# EAGLE design MS_8ADCPWM (EAGLE 7.3.0)
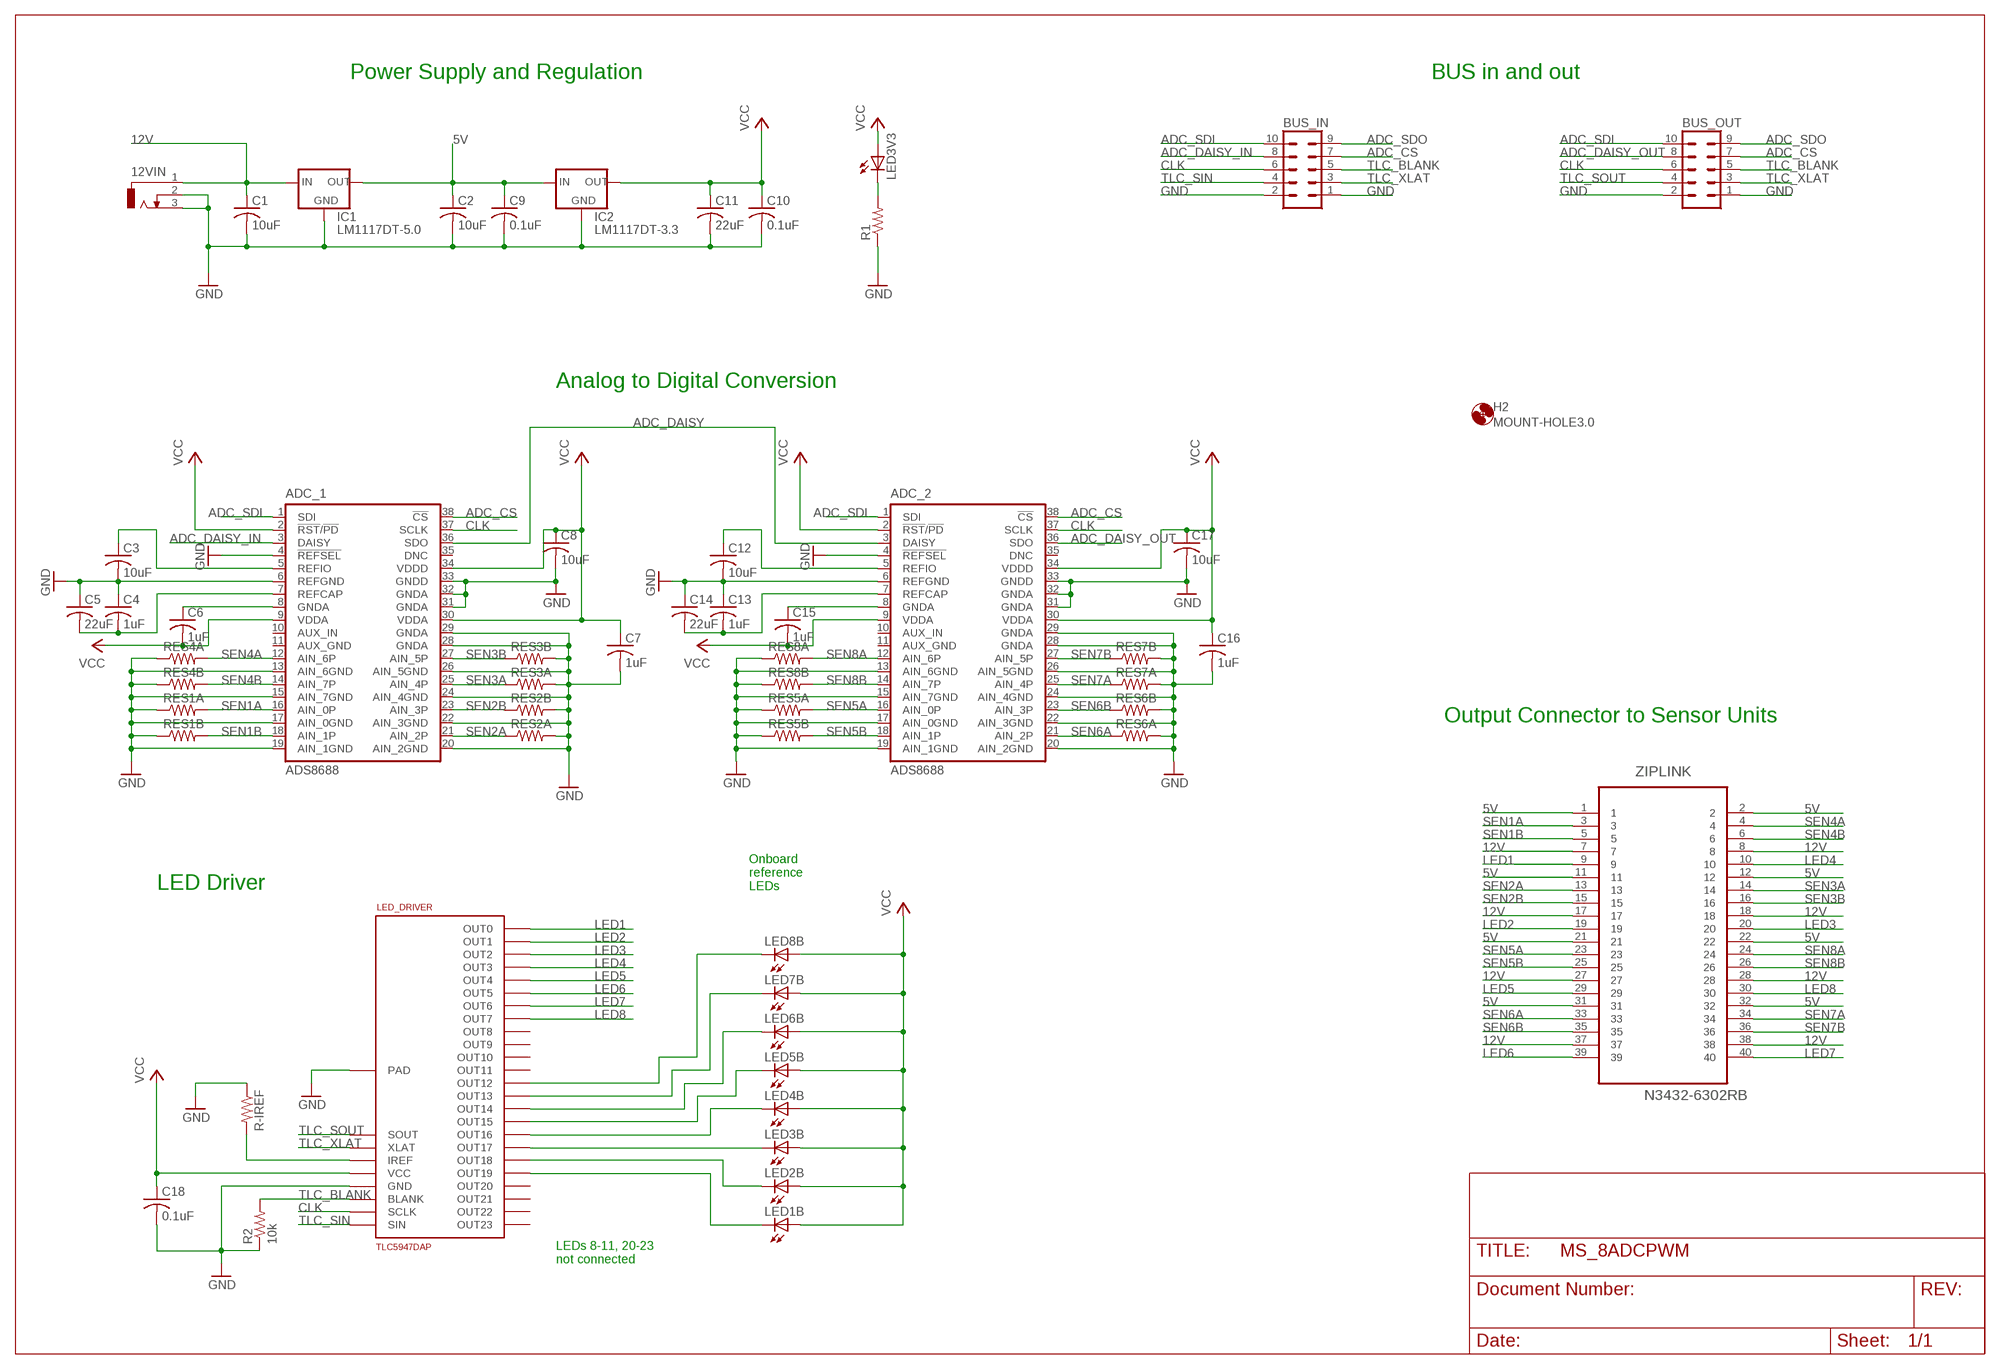
[diagram p0: schematic, sheet 1]

## Parts
12VIN  DCJ0303  [DCJ0303]
ADC_1  ADS8688  [DBT_R-PDSO-G38]
ADC_2  ADS8688  [DBT_R-PDSO-G38]
BUS_IN  ML10  [ML10]
BUS_OUT  ML10  [ML10]
C1  10uF  C-USC0805  [C0805]
C2  10uF  C-USC0805  [C0805]
C3  10uF  C-USC0805  [C0805]
C4  1uF  C-USC0805  [C0805]
C5  22uF  C-USC0805  [C0805]
C6  1uF  C-USC0805  [C0805]
C7  1uF  C-USC0805  [C0805]
C8  10uF  C-USC0805  [C0805]
C9  0.1uF  C-USC0805  [C0805]
C10  0.1uF  C-USC0805  [C0805]
C11  22uF  C-USC0805  [C0805]
C12  10uF  C-USC0805  [C0805]
C13  1uF  C-USC0805  [C0805]
C14  22uF  C-USC0805  [C0805]
C15  1uF  C-USC0805  [C0805]
C16  1uF  C-USC0805  [C0805]
C17  10uF  C-USC0805  [C0805]
C18  0.1uF  C-USC0805  [C0805]
H2  MOUNT-HOLE3.0  [3,0]
IC1  LM1117DT-5.0  [TO252]
IC2  LM1117DT-3.3  [TO252]
LED1B  LEDSMD2PLCC  [2-PLCC]
LED2B  LEDSMD2PLCC  [2-PLCC]
LED3B  LEDSMD2PLCC  [2-PLCC]
LED3V3  LEDCHIPLED_0805  [CHIPLED_0805]
LED4B  LEDSMD2PLCC  [2-PLCC]
LED5B  LEDSMD2PLCC  [2-PLCC]
LED6B  LEDSMD2PLCC  [2-PLCC]
LED7B  LEDSMD2PLCC  [2-PLCC]
LED8B  LEDSMD2PLCC  [2-PLCC]
LED_DRIVER  TLC5947DAP  [HTSSOP32DAP]
R1  R-US_R0805  [R0805]
R2  10k  R-US_R1206  [R1206]
R-IREF  R-US_R1206  [R1206]
RES1A  R-US_R1206  [R1206]
RES1B  R-US_R1206  [R1206]
RES2A  R-US_R1206  [R1206]
RES2B  R-US_R1206  [R1206]
RES3A  R-US_R1206  [R1206]
RES3B  R-US_R1206  [R1206]
RES4A  R-US_R1206  [R1206]
RES4B  R-US_R1206  [R1206]
RES5A  R-US_R1206  [R1206]
RES5B  R-US_R1206  [R1206]
RES6A  R-US_R1206  [R1206]
RES6B  R-US_R1206  [R1206]
RES7A  R-US_R1206  [R1206]
RES7B  R-US_R1206  [R1206]
RES8A  R-US_R1206  [R1206]
RES8B  R-US_R1206  [R1206]
ZIPLINK  N3432-6302RB  [3M_N3432-6302RB]

## Nets
5V: C2.1 C9.1 IC1.3(OUT) IC2.2(IN) ZIPLINK.1 ZIPLINK.2 ZIPLINK.11 ZIPLINK.12 ZIPLINK.21 ZIPLINK.22 ZIPLINK.31 ZIPLINK.32
12V: 12VIN.1 C1.1 IC1.2(IN) ZIPLINK.7 ZIPLINK.8 ZIPLINK.17 ZIPLINK.18 ZIPLINK.27 ZIPLINK.28 ZIPLINK.37 ZIPLINK.38
ADC_CS: ADC_1.38(!CS) ADC_2.38(!CS) BUS_IN.7 BUS_OUT.7
ADC_DAISY: ADC_1.36(SDO) ADC_2.3(DAISY)
ADC_DAISY_IN: ADC_1.3(DAISY) BUS_IN.8
ADC_DAISY_OUT: ADC_2.36(SDO) BUS_OUT.8
ADC_SDI: ADC_1.1(SDI) ADC_2.1(SDI) BUS_IN.10 BUS_OUT.10
ADC_SDO: BUS_IN.9 BUS_OUT.9
CLK: ADC_1.37(SCLK) ADC_2.37(SCLK) BUS_IN.6 BUS_OUT.6 LED_DRIVER.3(SCLK)
GND: 12VIN.2 12VIN.3 ADC_1.4(!REFSEL) ADC_1.6(REFGND) ADC_1.13(AIN_6GND) ADC_1.15(AIN_7GND) ADC_1.17(AIN_0GND) ADC_1.19(AIN_1GND) ADC_1.20(AIN_2GND) ADC_1.22(AIN_3GND) ADC_1.24(AIN_4GND) ADC_1.26(AIN_5GND) ADC_1.28(GNDA) ADC_1.29(GNDA) ADC_1.31(GNDA) ADC_1.32(GNDA) ADC_1.33(GNDD) ADC_2.4(!REFSEL) ADC_2.6(REFGND) ADC_2.13(AIN_6GND) ADC_2.15(AIN_7GND) ADC_2.17(AIN_0GND) ADC_2.19(AIN_1GND) ADC_2.20(AIN_2GND) ADC_2.22(AIN_3GND) ADC_2.24(AIN_4GND) ADC_2.26(AIN_5GND) ADC_2.28(GNDA) ADC_2.29(GNDA) ADC_2.31(GNDA) ADC_2.32(GNDA) ADC_2.33(GNDD) BUS_IN.1 BUS_IN.2 BUS_OUT.1 BUS_OUT.2 C1.2 C2.2 C3.2 C4.1 C5.1 C7.2 C8.2 C9.2 C10.2 C11.2 C12.2 C13.1 C14.1 C16.2 C17.2 C18.2 IC1.1(GND) IC2.1(GND) LED_DRIVER.1(GND) LED_DRIVER.EXP(PAD) R1.1 R2.1 R-IREF.1 RES1A.1 RES1B.1 RES2A.2 RES2B.2 RES3A.2 RES3B.2 RES4A.1 RES4B.1 RES5A.1 RES5B.1 RES6A.2 RES6B.2 RES7A.2 RES7B.2 RES8A.1 RES8B.1
LED1: LED_DRIVER.5(OUT0) ZIPLINK.9
LED2: LED_DRIVER.6(OUT1) ZIPLINK.19
LED3: LED_DRIVER.7(OUT2) ZIPLINK.20
LED4: LED_DRIVER.8(OUT3) ZIPLINK.10
LED5: LED_DRIVER.9(OUT4) ZIPLINK.29
LED6: LED_DRIVER.10(OUT5) ZIPLINK.39
LED7: LED_DRIVER.11(OUT6) ZIPLINK.40
LED8: LED_DRIVER.12(OUT7) ZIPLINK.30
N$1: ADC_1.5(REFIO) C3.1
N$2: LED3V3.C R1.2
N$5: ADC_2.7(REFCAP) C13.2 C14.2
N$6: ADC_1.7(REFCAP) C4.2 C5.2
N$7: ADC_2.5(REFIO) C12.1
N$8: ADC_2.8(GNDA) C15.1
N$10: ADC_1.8(GNDA) C6.1
N$12: LED1B.C LED_DRIVER.24(OUT19)
N$14: LED_DRIVER.31(IREF) R-IREF.2
N$22: LED2B.C LED_DRIVER.23(OUT18)
N$23: LED3B.C LED_DRIVER.22(OUT17)
N$24: LED4B.C LED_DRIVER.21(OUT16)
N$25: LED5B.C LED_DRIVER.20(OUT15)
N$26: LED6B.C LED_DRIVER.19(OUT14)
N$27: LED7B.C LED_DRIVER.18(OUT13)
N$28: LED8B.C LED_DRIVER.17(OUT12)
SEN1A: ADC_1.16(AIN_0P) RES1A.2 ZIPLINK.3
SEN1B: ADC_1.18(AIN_1P) RES1B.2 ZIPLINK.5
SEN2A: ADC_1.21(AIN_2P) RES2A.1 ZIPLINK.13
SEN2B: ADC_1.23(AIN_3P) RES2B.1 ZIPLINK.15
SEN3A: ADC_1.25(AIN_4P) RES3A.1 ZIPLINK.14
SEN3B: ADC_1.27(AIN_5P) RES3B.1 ZIPLINK.16
SEN4A: ADC_1.12(AIN_6P) RES4A.2 ZIPLINK.4
SEN4B: ADC_1.14(AIN_7P) RES4B.2 ZIPLINK.6
SEN5A: ADC_2.16(AIN_0P) RES5A.2 ZIPLINK.23
SEN5B: ADC_2.18(AIN_1P) RES5B.2 ZIPLINK.25
SEN6A: ADC_2.21(AIN_2P) RES6A.1 ZIPLINK.33
SEN6B: ADC_2.23(AIN_3P) RES6B.1 ZIPLINK.35
SEN7A: ADC_2.25(AIN_4P) RES7A.1 ZIPLINK.34
SEN7B: ADC_2.27(AIN_5P) RES7B.1 ZIPLINK.36
SEN8A: ADC_2.12(AIN_6P) RES8A.2 ZIPLINK.24
SEN8B: ADC_2.14(AIN_7P) RES8B.2 ZIPLINK.26
TLC_BLANK: BUS_IN.5 BUS_OUT.5 LED_DRIVER.2(BLANK) R2.2
TLC_SIN: BUS_IN.4 LED_DRIVER.4(SIN)
TLC_SOUT: BUS_OUT.4 LED_DRIVER.29(SOUT)
TLC_XLAT: BUS_IN.3 BUS_OUT.3 LED_DRIVER.30(XLAT)
VCC: ADC_1.2(!RST!/!PD) ADC_1.9(VDDA) ADC_1.30(VDDA) ADC_1.34(VDDD) ADC_2.2(!RST!/!PD) ADC_2.9(VDDA) ADC_2.30(VDDA) ADC_2.34(VDDD) C6.2 C7.1 C8.1 C10.1 C11.1 C15.2 C16.1 C17.1 C18.1 IC2.3(OUT) LED1B.A LED2B.A LED3B.A LED3V3.A LED4B.A LED5B.A LED6B.A LED7B.A LED8B.A LED_DRIVER.32(VCC)
Unconnected: ADC_1.10(AUX_IN) ADC_1.11(AUX_GND) ADC_1.35(DNC) ADC_2.10(AUX_IN) ADC_2.11(AUX_GND) ADC_2.35(DNC) LED_DRIVER.13(OUT8) LED_DRIVER.14(OUT9) LED_DRIVER.15(OUT10) LED_DRIVER.16(OUT11) LED_DRIVER.25(OUT20) LED_DRIVER.26(OUT21) LED_DRIVER.27(OUT22) LED_DRIVER.28(OUT23)

## Notes on the sheet
- Power Supply and Regulation | BUS in and out
- Analog to Digital Conversion
- Output Connector to Sensor Units
- LED Driver
- Onboard
  reference 
  LEDs
- LEDs 8-11, 20-23
  not connected

## Library data of the parts
12VIN = con-jack:DCJ0303: DC POWER JACK Source: DCJ0303.pdf; OC_FARNELL: unknown; OC_NEWARK: unknown
ADC_1 ADC_2 = texas:ADS8688: ADS868x 16-Bit, 500-kSPS, 8-Channel, Single-Supply, SAR ADCs with Bipolar Input Ranges Source: Data sheet <http://www.ti.com/lit/ds/symlink/ads8688.pdf>
BUS_IN BUS_OUT = con-ml:ML10: HARTING; OC_FARNELL: unknown; OC_NEWARK: unknown
C1-C18 = rcl:C-US: CAPACITOR, American symbol
H2 = holes:MOUNT-HOLE: MOUNTING HOLE with drill center marker
IC1 = lm1117_10:LM1117?-*: 800mA Low-Dropout Linear Regulator Source: http://www.ti.com/lit/ds/symlink/lm1117-n.pdf; MF: Texas Instruments; MPN: LM1117DT-5.0; OC_FARNELL: 9486283; OC_NEWARK: 41K3431
IC2 = lm1117_10:LM1117?-*: 800mA Low-Dropout Linear Regulator Source: http://www.ti.com/lit/ds/symlink/lm1117-n.pdf; MF: Texas Instruments; MPN: LM1117DT-3.3; OC_FARNELL: 1469048; OC_NEWARK: 41K3430
LED1B LED2B LED3B LED3V3 LED4B LED5B LED6B LED7B LED8B = led:LED: LED OSRAM: - CHIPLED LG R971, LG N971, LY N971, LG Q971, LY Q971, LO R971, LY R971 LH N974, LH R974 LS Q976, LO Q976, LY Q976 LO Q996 - Hyper CHIPLED LW Q18S LB Q993, LB Q99A, LB R99A - SideLED LS A670, LO A670, LY A670, LG A670, LP A670 LB A673, LV A673, LT A673, LW A673 LH A674 LY A675 LS A676, LA A676, LO A676, LY A676, LW A676 LS A679, LY A679, LG A679 - Hyper Micro SIDELED® LS Y876, LA Y876, LO Y876, LY Y876 LT Y87S - SmartLED LW L88C, LW L88S LB L89C, LB L89S, LG L890 LS L89K, LO L89K, LY L89K LS L896, LA L896, LO L896, LY L896 - TOPLED LS T670, LO T670, LY T670, LG T670, LP T670 LSG T670, LSP T670, LSY T670, LOP T670, LYG T670 LG T671, LOG T671, LSG T671 LB T673, LV T673, LT T673, LW T673 LH T674 LS T676, LA T676, LO T676, LY T676, LB T676, LH T676, LSB T676, LW T676 LB T67C, LV T67C, LT T67C, LS T67K, LO T67K, LY T67K, LW E67C LS E67B, LA E67B, LO E67B, LY E67B, LB E67C, LV E67C, LT E67C LW T67C LS T679, LY T679, LG T679 LS T770, LO T770, LY T770, LG T770, LP T770 LB T773, LV T773, LT T773, LW T773 LH T774 LS E675, LA E675, LY E675, LS T675 LS T776, LA T776, LO T776, LY T776, LB T776 LHGB T686 LT T68C, LB T68C - Hyper Mini TOPLED® LB M676 - Mini TOPLED Santana® LG M470 LS M47K, LO M47K, LY M47K Source: http://www.osram.convergy.de LUXEON: - LUMILED® LXK2-PW12-R00, LXK2-PW12-S00, LXK2-PW14-U00, LXK2-PW14-V00 LXK2-PM12-R00, LXK2-PM12-S00, LXK2-PM14-U00 LXK2-PE12-Q00, LXK2-PE12-R00, LXK2-PE12-S00, LXK2-PE14-T00, LXK2-PE14-U00 LXK2-PB12-K00, LXK2-PB12-L00, LXK2-PB12-M00, LXK2-PB14-N00, LXK2-PB14-P00, LXK2-PB14-Q00 LXK2-PR12-L00, LXK2-PR12-M00, LXK2-PR14-Q00, LXK2-PR14-R00 LXK2-PD12-Q00, LXK2-PD12-R00, LXK2-PD12-S00 LXK2-PH12-R00, LXK2-PH12-S00 LXK2-PL12-P00, LXK2-PL12-Q00, LXK2-PL12-R00 Source: www.luxeon.com KINGBRIGHT: KA-3528ASYC Source: www.kingbright.com
LED_DRIVER = TLC5947:TLC5947
R1 R2 R-IREF RES1A RES1B RES2A RES2B RES3A RES3B RES4A RES4B RES5A RES5B RES6A RES6B RES7A RES7B RES8A RES8B = resistor:R-US_: RESISTOR, American symbol
ZIPLINK = N3432-6302RB:N3432-6302RB: CONN HEADER 40POS STR LONG LATCH; AVAILABILITY: Good; DESCRIPTION: .100 Latch/Ejector Headers 40P STRT LONG PIN SOLDER TAIL 30u GOLD; MF: 3M; MP: N3432-6302RB; PACKAGE: None; PRICE: 3.63 USD

## Board
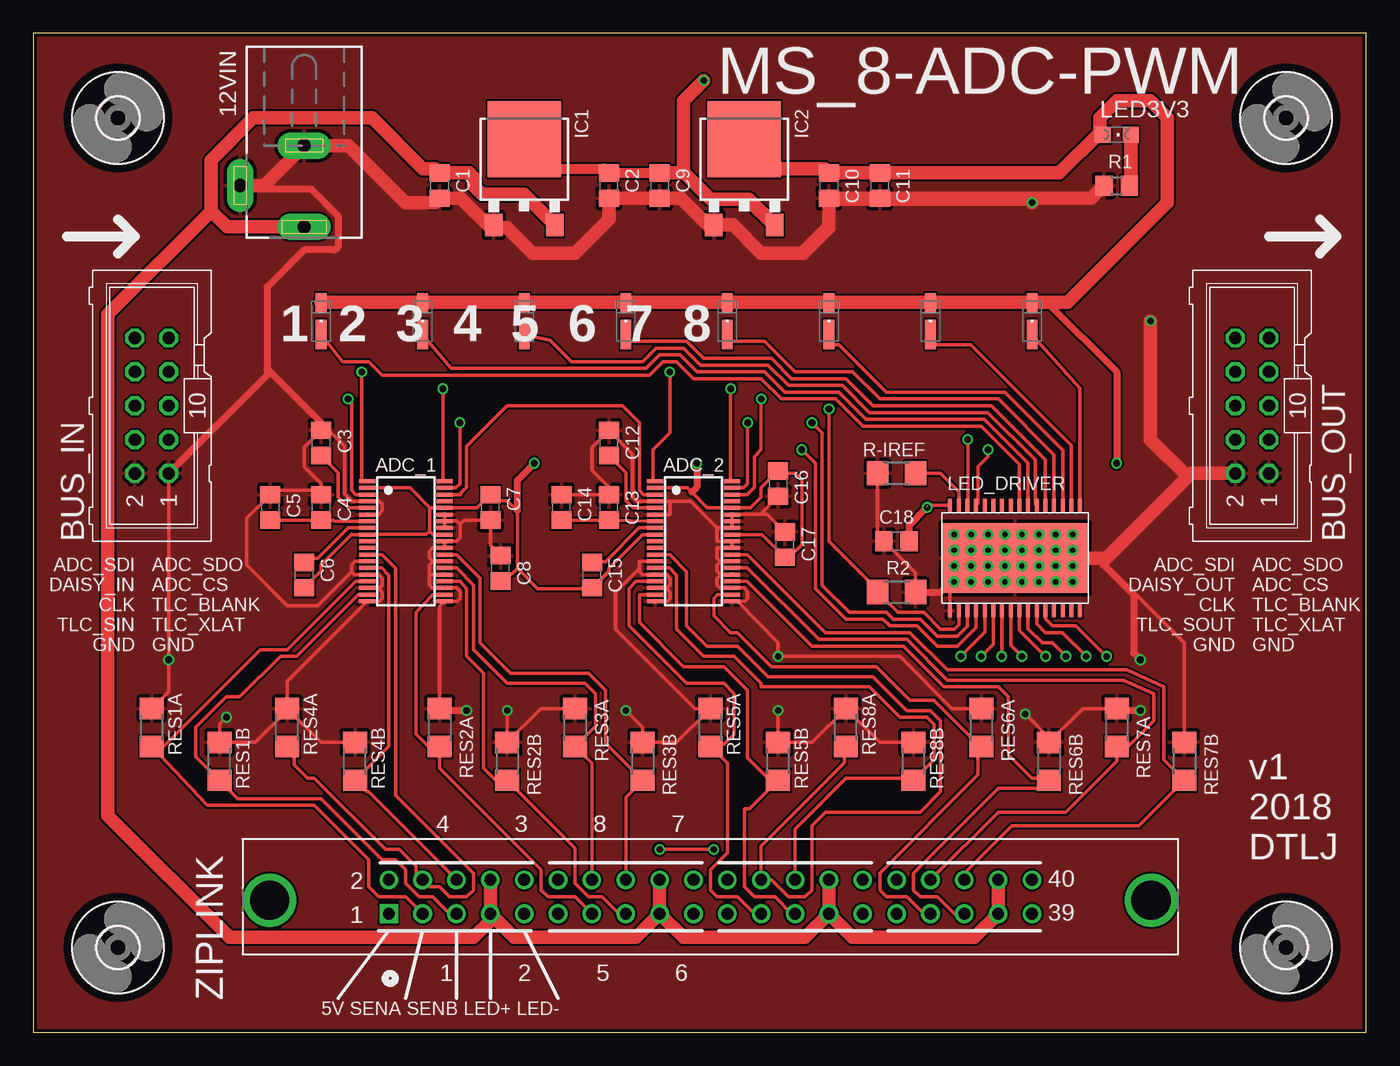
[diagram p1: board, top side]
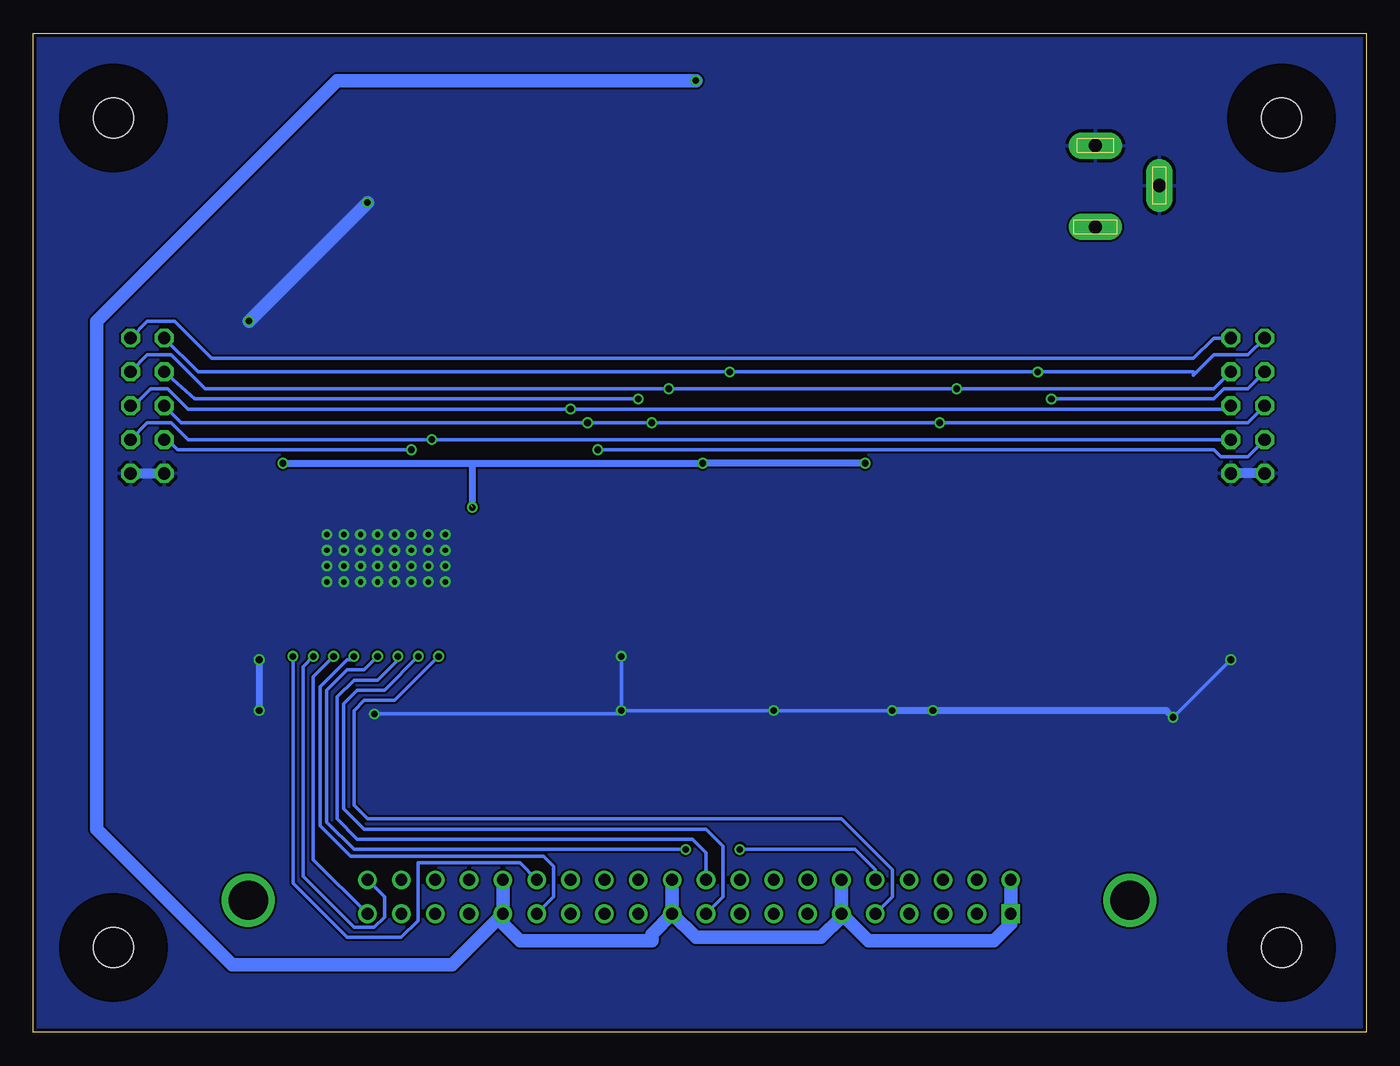
[diagram p2: board, bottom side, seen from below]

Size 100 x 74.92 mm. Coordinates in mm from the lower left corner, seen from the top.
Outline: 0,0 100,0 100,74.92 0,74.92 0,0
Copper layers (1*16): Top 0.035mm / dielectric 1.5mm / Bottom 0.035mm
Design rules "seeed": minimum track width 6mil, minimum drill 12mil, track to track 6mil, track to pad 6mil, pad to pad 7mil, via to via 6mil, smd to smd 0mil, copper to edge 10mil, drill to drill 10mil, minimum pad ring 10mil, minimum via ring 6mil, stop-mask expansion 2mil, vias tented up to drill 100mil, thermal gap 10mil

### Footprints (pad centres in the part's own frame; a part is rotated, then mirrored left to right if it is on the bottom)
DCJ0303 = drill 1 pad 2 long: 1 0,3.1; 2 4.8,0; 3 0,-3
DBT_R-PDSO-G38 = smd 0.3 x 1.2: 1 -4.5,-2.9; 2 -4,-2.9; 3 -3.5,-2.9; 4 -3,-2.9; 5 -2.5,-2.9; 6 -2,-2.9; 7 -1.5,-2.9; 8 -1,-2.9; 9 -0.5,-2.9; 10 0,-2.9; 11 0.5,-2.9; 12 1,-2.9; 13 1.5,-2.9; 14 2,-2.9; 15 2.5,-2.9; 16 3,-2.9; 17 3.5,-2.9; 18 4,-2.9; 19 4.5,-2.9; 20 4.5,2.9; 21 4,2.9; 22 3.5,2.9; 23 3,2.9; 24 2.5,2.9; 25 2,2.9; 26 1.5,2.9; 27 1,2.9; 28 0.5,2.9; 29 0,2.9; 30 -0.5,2.9; 31 -1,2.9; 32 -1.5,2.9; 33 -2,2.9; 34 -2.5,2.9; 35 -3,2.9; 36 -3.5,2.9; 37 -4,2.9; 38 -4.5,2.9
ML10 = drill 0.914 octagon: 1 -5.08,-1.27; 2 -5.08,1.27; 3 -2.54,-1.27; 4 -2.54,1.27; 5 0,-1.27; 6 0,1.27; 7 2.54,-1.27; 8 2.54,1.27; 9 5.08,-1.27; 10 5.08,1.27
C0805 = smd 1.3 x 1.5: 1 -0.95,0; 2 0.95,0
3,0 = hole 3: 0,0
TO252 = smd 1.3 x 1.7: 1 -2.285,-4.22; 2 2.285,-4.22 | smd 5.5 x 5.7: 3 0,2.22
2-PLCC = smd 1.4 x 0.8: A -1.397,0 | smd 2.2 x 0.8: C 1.016,0
CHIPLED_0805 = smd 1.2 x 1.2: A 0,-1.05; C 0,1.05
HTSSOP32DAP = smd 0.3 x 1: 1 -4.875,-3.95; 2 -4.225,-3.95; 3 -3.575,-3.95; 4 -2.925,-3.95; 5 -2.275,-3.95; 6 -1.625,-3.95; 7 -0.975,-3.95; 8 -0.325,-3.95; 9 0.325,-3.95; 10 0.975,-3.95; 11 1.625,-3.95; 12 2.275,-3.95; 13 2.925,-3.95; 14 3.575,-3.95; 15 4.225,-3.95; 16 4.875,-3.95; 17 4.875,3.95; 18 4.225,3.95; 19 3.575,3.95; 20 2.925,3.95; 21 2.275,3.95; 22 1.625,3.95; 23 0.975,3.95; 24 0.325,3.95; 25 -0.325,3.95; 26 -0.975,3.95; 27 -1.625,3.95; 28 -2.275,3.95; 29 -2.925,3.95; 30 -3.575,3.95; 31 -4.225,3.95; 32 -4.875,3.95 | smd 11 x 5.2: EXP 0,0
R0805 = smd 1.3 x 1.5: 1 -0.95,0; 2 0.95,0
R1206 = smd 1.6 x 1.803: 1 -1.422,0; 2 1.422,0
3M_N3432-6302RB = drill 0.889 square: 1 -48.26,-2.54 | drill 0.889: 2 -48.26,0; 3 -45.72,-2.54; 4 -45.72,0; 5 -43.18,-2.54; 6 -43.18,0; 7 -40.64,-2.54; 8 -40.64,0; 9 -38.1,-2.54; 10 -38.1,0; 11 -35.56,-2.54; 12 -35.56,0; 13 -33.02,-2.54; 14 -33.02,0; 15 -30.48,-2.54; 16 -30.48,0; 17 -27.94,-2.54; 18 -27.94,0; 19 -25.4,-2.54; 20 -25.4,0; 21 -22.86,-2.54; 22 -22.86,0; 23 -20.32,-2.54; 24 -20.32,0; 25 -17.78,-2.54; 26 -17.78,0; 27 -15.24,-2.54; 28 -15.24,0; 29 -12.7,-2.54; 30 -12.7,0; 31 -10.16,-2.54; 32 -10.16,0; 33 -7.62,-2.54; 34 -7.62,0; 35 -5.08,-2.54; 36 -5.08,0; 37 -2.54,-2.54; 38 -2.54,0; 39 0,-2.54; 40 0,0 | drill 2.946: 41 -57.201,-1.524; 42 8.941,-1.524

### Placement (x,y rotation side)
12VIN  20.32,63.5 180 top
ADC_1  27.94,36.83 270 top
ADC_2  49.53,36.83 270 top
BUS_IN  8.89,46.99 90 top
BUS_OUT  91.44,46.99 90 top
C1  30.48,63.5 270 top
C2  43.18,63.5 270 top
C3  21.59,44.2 90 top
C4  21.59,39.37 270 top
C5  17.78,39.37 270 top
C6  20.32,34.29 270 top
C7  34.29,39.37 270 top
C8  35.05,34.8 90 top
C9  46.99,63.5 270 top
C10  59.69,63.5 270 top
C11  63.5,63.5 270 top
C12  43.18,44.2 90 top
C13  43.18,39.37 270 top
C14  39.62,39.37 270 top
C15  41.91,34.29 270 top
C16  55.88,41.15 270 top
C17  56.39,36.58 90 top
C18  64.77,36.83 180 top
H1  MOUNT-HOLE3.0  [3,0]  6.35,68.58 0 top
H2  6.35,6.35 0 top
H3  MOUNT-HOLE3.0  [3,0]  93.98,68.58 0 top
H4  MOUNT-HOLE3.0  [3,0]  93.98,6.35 0 top
IC1  36.83,64.77 0 top
IC2  53.34,64.77 0 top
LED1B  21.59,53.34 270 top
LED2B  29.21,53.34 270 top
LED3B  36.83,53.34 270 top
LED3V3  81.28,67.31 270 top
LED4B  44.45,53.34 270 top
LED5B  52.07,53.34 270 top
LED6B  59.69,53.34 270 top
LED7B  67.31,53.34 270 top
LED8B  74.93,53.34 270 top
LED_DRIVER  73.66,35.56 0 top
R1  81.28,63.5 0 top
R2  64.77,33.02 180 top
R-IREF  64.77,41.91 0 top
RES1A  8.89,22.86 270 top
RES1B  13.97,20.32 270 top
RES2A  30.48,22.86 90 top
RES2B  35.56,20.32 90 top
RES3A  40.64,22.86 90 top
RES3B  45.72,20.32 90 top
RES4A  19.05,22.86 270 top
RES4B  24.13,20.32 270 top
RES5A  50.8,22.86 270 top
RES5B  55.88,20.32 270 top
RES6A  71.12,22.86 90 top
RES6B  76.2,20.32 90 top
RES7A  81.28,22.86 90 top
RES7B  86.36,20.32 90 top
RES8A  60.96,22.86 270 top
RES8B  66.04,20.32 270 top
ZIPLINK  74.93,11.43 0 top

### Tracks (layer width: path | path; a pad name or v marks a point on that pad's centre or on a via)
5V  (via drill 0.5)
  Top 0.762: C9.1 C2.1 42.86,64.77 38.1,64.77 36.83,66.04 IC1.3
  Top 1.016: C9.1 48.83,64.45 | 48.83,64.45 50.8,62.48 53.59,62.48 | 53.59,62.48 53.69,62.48 IC2.2 55.53,60.55 53.59,62.48 | 48.83,64.45 48.77,64.52 48.77,69.85 v50.29,71.37
  Bottom 1.016: ZIPLINK.1 ZIPLINK.2 26.67,8.13 27.94,6.86 37.34,6.86 ZIPLINK.11 ZIPLINK.12 39.37,8.64 40.89,7.11 50.29,7.11 ZIPLINK.21 | ZIPLINK.22 ZIPLINK.21 | 64.77,8.64 ZIPLINK.31 | ZIPLINK.32 ZIPLINK.31 | ZIPLINK.31 64.77,8.13 63.5,6.86 53.59,6.86 53.59,7.37 ZIPLINK.21 | v50.29,71.37 77.22,71.37 95.25,53.34 95.25,15.24 85.09,5.08 68.58,5.08 ZIPLINK.31
12V
  Top 0.762: IC1.2 39.12,60.58 | C1.1 30.48,64.77
  Top 1.016: 12VIN.1 14.53,60.4 13.34,61.59 | 13.34,61.59 13.34,65.41 16.51,68.58 25.4,68.58 29.21,64.77 30.16,64.77 C1.1 32.7,64.45 33.02,64.14 33.02,63.5 33.66,62.87 36.83,62.87 37.47,62.2 IC1.2 | ZIPLINK.18 ZIPLINK.17 | ZIPLINK.38 ZIPLINK.37 70.61,7.11 61.47,7.11 ZIPLINK.27 | ZIPLINK.7 36.07,7.11 45.21,7.11 ZIPLINK.17 | ZIPLINK.8 ZIPLINK.7 | ZIPLINK.7 34.29,8.38 33.02,7.11 14.73,7.11 5.59,16.26 5.59,53.85 13.34,61.59 | ZIPLINK.28 ZIPLINK.27 | ZIPLINK.27 57.91,7.11 48.77,7.11 ZIPLINK.17
ADC_CS  (via drill 0.5)
  Top 0.254: ADC_1.38 30.73,41.33 v30.73,48.26 | ADC_2.38 52.32,41.33 v52.32,48.26
  Bottom 0.254: BUS_IN.7 11.43,48.26 v30.73,48.26 v52.32,48.26 87.12,48.26 89.66,50.8 91.44,50.8 BUS_OUT.7
ADC_DAISY
  Top 0.254: ADC_1.36 32.06,40.33 32.06,40.44 32.51,40.89 32.51,43.94 35.56,46.99 44.2,46.99 45.47,45.72 45.47,40.64 45.78,40.33 ADC_2.3
ADC_DAISY_IN  (via drill 0.5)
  Top 0.254: ADC_1.3 24.19,40.33 23.88,40.64 23.88,47.5 v23.62,47.5
  Bottom 0.254: v23.62,47.5 11.43,47.5 10.67,48.26 8.89,48.26 BUS_IN.8
ADC_DAISY_OUT  (via drill 0.5)
  Top 0.254: v54.61,47.5 54.61,43.69 54.1,43.18 54.1,40.89 53.54,40.33 ADC_2.36
  Bottom 0.254: v54.61,47.5 87.88,47.5 BUS_OUT.8
ADC_SDI  (via drill 0.5)
  Top 0.254: ADC_1.1 24.64,41.33 v24.64,49.53 | 46.48,41.33 ADC_2.1 46.48,41.48 46.48,43.69 47.75,44.96 v47.75,49.53
  Bottom 0.254: BUS_IN.10 8.89,50.8 11.43,50.8 12.95,49.28 12.95,49.53 v24.64,49.53 v47.75,49.53 87.63,49.53 BUS_OUT.10
ADC_SDO
  Bottom 0.254: BUS_IN.9 11.43,52.07 12.95,50.55 86.61,50.55 89.41,53.34 91.44,53.34 BUS_OUT.9
CLK  (via drill 0.5)
  Top 0.254: LED_DRIVER.3 70.08,30.46 69.34,29.72 67.82,29.72 66.55,30.99 64.52,30.99 64.01,31.5 61.21,31.5 59.18,33.53 59.18,44.96 v58.42,45.72 | ADC_2.37 52.49,40.83 53.28,40.83 53.59,41.15 v53.59,45.72 | ADC_1.37 31.69,40.83 32,41.15 v32,45.72
  Bottom 0.254: BUS_IN.6 8.89,45.72 v32,45.72 v53.59,45.72 v58.42,45.72 88.9,45.72 BUS_OUT.6
GND  (via drill 0.4 pad 0.8, 0.5)
  Top 0.254: 25.91,33.33 26.16,33.02 26.16,32.51 25.98,32.33 ADC_1.19 19.05,26.34 19.05,25.07 | ADC_1.17 25.91,33.33 | 25.91,33.33 25.96,33.33 26.16,33.53 26.16,34.04 25.91,34.33 ADC_1.15 24.09,34.33 23.88,34.54 | RES4B.1 21.59,21.74 RES4A.1 | RES3A.2 38.1,24.28 RES2B.2 v35.56,24.13 | RES2A.2 30.48,31.97 ADC_1.20 31.82,32.33 32,32.51 32,33.08 31.75,33.33 ADC_1.22 29.92,33.33 29.72,33.53 29.72,34.33 | 29.72,34.33 30.8,34.33 ADC_1.24 | 29.72,34.33 29.72,35.05 30,35.33 ADC_1.26 29.95,35.33 29.72,35.56 29.72,36.07 29.97,36.32 ADC_1.28 ADC_1.29 31.75,36.83 32,37.08 32,38.1 | BUS_IN.1 v10.16,27.94 10.16,25.55 RES1A.1 | 32,38.1 31.75,38.35 30.86,38.35 ADC_1.32 | ADC_1.32 ADC_1.33 | ADC_1.32 ADC_1.31 | 32,38.1 32.32,38.42 C7.2 34.29,36.51 C8.2 | 19.05,24.13 16.66,21.74 RES1B.1 13.97,23.11 v14.48,23.62 | ADC_2.19 47.57,32.33 47.75,32.51 47.75,33.02 47.5,33.33 46.69,33.33 ADC_2.17 47.55,33.33 47.75,33.53 47.75,34.04 47.5,34.33 46.99,34.33 | 46.99,34.33 46.67,34.33 | 46.67,34.33 ADC_2.15 46.95,34.33 46.99,34.33 | 46.67,34.33 45.72,34.33 45.47,34.54 45.47,34.8 | 45.47,34.8 45.47,35.33 46.61,35.33 ADC_2.13 | 52.83,32.33 53.41,32.33 53.59,32.51 53.59,33.02 53.34,33.33 52.49,33.33 ADC_2.22 51.51,33.33 51.31,33.53 51.31,34.04 51.56,34.33 | 51.56,34.33 52.39,34.33 ADC_2.24 | 51.31,37.85 51.31,36.83 ADC_2.29 ADC_2.28 51.31,36.32 51.31,35.56 51.56,35.31 | 51.31,37.85 52.41,37.85 ADC_2.31 ADC_2.32 ADC_2.33 52.46,38.84 54.54,38.84 | 55.88,37.08 C17.2 55.05,38.86 54.54,38.84 | 47.75,39.83 ADC_2.4 45.26,39.83 44.96,40.13 44.96,43.37 C12.2 41.91,43.88 41.91,42.16 43.18,40.89 C13.1 C14.1
  Top 0.254: 47.75,39.83 49.32,39.83 51.31,37.85 | 54.54,38.84 C16.2 | R-IREF.1 63.35,37.3 C18.2 66.19,34.46 R2.1 66.29,33.02 | 68.53,33.48 68.61,33.47 | 68.61,33.47 71.88,33.27 72.64,34.54 LED_DRIVER.EXP | RES7B.2 86.36,29.21 80.26,35.31 80.01,35.56 | RES7A.2 78.74,24.28 RES6B.2 76.2,22.1 v74.42,23.88 | RES6A.2 68.94,24.28 65.02,28.19 v55.88,28.19 | v44.45,24.13 45.72,22.86 RES3B.2 48.26,21.74 RES5A.1 49.63,24.28 43.69,30.23 43.69,33.02 45.47,34.8 | v55.88,24.13 RES5B.1 58.42,21.74 RES8A.1 63.5,21.74 RES8B.1 | 21.34,44.89 21.84,45.47 23.37,43.94 23.37,40.39 23.92,39.83 ADC_1.4 25.96,39.83 26.16,39.62 26.16,39.12 25.91,38.83 ADC_1.6 | 21.34,44.89 20.32,43.88 20.32,42.42 21.59,41.15 C4.1 21.27,40.64 17.78,40.64 C5.1 16,38.54 16,35.05 19.05,32 21.34,32 23.88,34.54 | 21.34,44.89 C3.2 | 23.88,34.54 23.88,35.05 24.15,35.33 ADC_1.13 | ADC_2.6 47.72,38.83 47.75,38.86 47.75,39.83 | 55.88,27.94 v55.88,28.19 | v55.88,28.19 55.88,29.21 52.83,32.33 | 52.83,32.33 ADC_2.20 | 51.56,35.31 51.31,35.05 51.31,34.58 51.56,34.33 | ADC_2.26 51.59,35.33 51.56,35.31 | LED_DRIVER.1 68.78,33.3 68.61,33.47
  Top 0.508: v32.51,24.13 30.63,24.13 RES2A.2 | 73.91,34.8 73.66,35.81 79.76,35.81 80.26,35.31 80.26,35.05 82.55,32.77 82.55,28.45 v83.06,27.94 | v83.06,24.13 81.43,24.13 RES7A.2 | 16.76,63.25 20.83,63.25 22.86,61.21 22.86,58.93 22.61,58.67 20.32,58.67 17.53,55.88 17.53,49.78 | 17.53,49.78 17.53,49.28 | 21.59,45.72 17.78,49.53 | 17.53,49.78 17.78,49.53 | 17.78,49.53 17.53,49.28 | 17.53,49.28 BUS_IN.1 | 66.29,33.02 68.07,33.02 68.53,33.48
  Top 0.762: C1.2 30.48,62.23
  Top 1.016: 12VIN.2 17.32,63.5 12VIN.3 23.67,66.5 27.94,62.23 30.16,62.23 C1.2 32.06,62.55 34.29,60.33 35.56,60.33 37.47,58.42 40.64,58.42 43.18,60.96 C2.2 C9.2 48.58,62.55 50.8,60.33 50.83,60.33 IC2.1 52.48,60.55 54.61,58.42 57.78,58.42 | 57.78,58.42 59.69,60.33 59.69,60.45 | 59.69,62.23 C10.2 C11.2 79.38,62.55 R1.1 | BUS_OUT.2 86.87,41.91 86.61,41.66 | 86.61,41.66 80.52,35.56 80.01,35.56 LED_DRIVER.EXP | 57.78,58.42 57.78,58.55 59.69,60.45 | 59.69,60.45 59.69,62.23 | 59.69,62.23 59.94,62.48 74.68,62.48 v74.93,62.23 | v83.82,53.34 83.82,44.45 86.61,41.66
  Bottom 0.254: v14.48,23.62 v10.16,27.94 | v35.56,24.13 v44.45,24.13 v55.88,24.13 | v74.42,23.88 56.13,23.88 v55.88,24.13 | v55.88,28.19 v55.88,24.13
  Bottom 0.508: v14.48,23.62 14.99,24.13 v32.51,24.13 v35.56,24.13 | v83.06,27.94 v83.06,24.13
  Bottom 0.762: BUS_IN.2 BUS_IN.1 | BUS_OUT.1 BUS_OUT.2
  Bottom 1.016: v74.93,62.23 v83.82,53.34
  other vias: 69.09,37.34 69.09,36.15 69.09,34.97 69.09,33.78 70.36,37.34 70.36,36.15 70.36,34.97 70.36,33.78 71.63,37.34 71.63,36.15 71.63,34.97 71.63,33.78 72.9,37.34 72.9,36.15 72.9,34.97 72.9,33.78 74.17,37.34 74.17,36.15 74.17,34.97 74.17,33.78 75.44,37.34 75.44,36.15 75.44,34.97 75.44,33.78 76.71,37.34 76.71,36.15 76.71,34.97 76.71,33.78 77.98,37.34 77.98,36.15 77.98,34.97 77.98,33.78
  pour Bottom: 0,74.93 100.33,74.93 100.33,0 0,0
  pour Top: 0,74.93 100.33,74.93 100.33,0 0,0
LED1  (via drill 0.5)
  Top 0.254: LED_DRIVER.5 71.39,29.98 v69.6,28.19
  Bottom 0.254: ZIPLINK.9 35.56,10.16 35.56,12.19 39.37,16 74.93,16 75.95,17.02 75.95,24.13 75.18,24.89 72.9,24.89 v69.6,28.19
LED2  (via drill 0.5)
  Top 0.254: LED_DRIVER.6 72.03,29.11 v71.12,28.19
  Bottom 0.254: ZIPLINK.19 48.26,10.16 48.26,13.97 49.53,15.24 75.18,15.24 76.71,16.76 76.71,24.64 75.69,25.65 73.66,25.65 v71.12,28.19
LED3  (via drill 0.5)
  Top 0.254: LED_DRIVER.7 72.69,28.66 v72.64,28.19
  Bottom 0.254: v72.64,28.19 72.64,27.94 74.17,26.42 75.95,26.42 77.22,25.15 77.22,16 75.69,14.48 50.55,14.48 49.53,13.46 ZIPLINK.20
LED4  (via drill 0.5)
  Top 0.254: LED_DRIVER.8 73.33,29.03 v74.17,28.19 | v46.99,13.72 v51.05,13.72
  Bottom 0.254: ZIPLINK.10 36.83,12.19 38.35,13.72 v46.99,13.72 | v74.17,28.19 75.18,27.18 76.45,27.18 77.98,25.65 77.98,15.75 75.95,13.72 v51.05,13.72
LED5  (via drill 0.5)
  Top 0.254: LED_DRIVER.9 73.98,30.16 v75.95,28.19
  Bottom 0.254: v75.95,28.19 75.95,27.94 76.45,27.94 78.49,25.91 78.49,15.49 76.2,13.21 61.72,13.21 60.96,12.45 60.96,10.16 ZIPLINK.29
LED6  (via drill 0.5)
  Top 0.254: LED_DRIVER.10 74.64,30.27 75.69,29.21 76.45,29.21 v77.47,28.19
  Bottom 0.254: ZIPLINK.39 78.99,12.95 78.99,26.67 v77.47,28.19
LED7  (via drill 0.5)
  Top 0.254: LED_DRIVER.11 75.28,30.63 75.95,29.97 77.22,29.97 v78.99,28.19
  Bottom 0.254: ZIPLINK.40 73.66,10.16 73.66,8.64 74.42,7.87 75.95,7.87 79.76,11.68 79.76,27.43 v78.99,28.19
LED8  (via drill 0.5)
  Top 0.254: LED_DRIVER.12 75.94,31 76.45,30.48 78.23,30.48 v80.52,28.19
  Bottom 0.254: v80.52,28.19 80.52,11.18 76.45,7.11 72.39,7.11 71.12,8.38 71.12,12.7 63.5,12.7 ZIPLINK.30
N$1
  Top 0.254: ADC_1.5 23.66,39.33 22.86,40.13 22.86,41.98 C3.1
N$2
  Top 1.016: LED3V3.C 82.33,63.6 R1.2
N$5
  Top 0.254: C14.2 C13.2 46.54,38.33 ADC_2.7
N$6
  Top 0.254: C5.2 C4.2 22.54,38.42 22.61,38.33 ADC_1.7
N$7
  Top 0.254: ADC_2.5 45,39.33 44.45,39.88 44.45,41.98 C12.1
N$8
  Top 0.254: ADC_2.8 45.45,37.83 42.93,35.31 41.98,35.31 C15.1
N$10
  Top 0.254: ADC_1.8 23.61,37.83 21.34,35.56 20.64,35.56 C6.1
N$12
  Top 0.254: LED_DRIVER.24 73.98,42.6 71.12,45.47 62.23,45.47 60.2,47.5 56.13,47.5 54.61,49.02 49.53,49.02 48.26,50.29 47.24,50.29 46.23,49.28 26.16,49.28 25.15,50.29 23.22,50.29 LED1B.C
N$14
  Top 0.254: LED_DRIVER.31 69.44,40.55 68.07,41.91 R-IREF.2
N$22
  Top 0.254: LED_DRIVER.23 74.64,42.71 71.37,45.97 62.48,45.97 60.45,48.01 56.39,48.01 54.86,49.53 49.78,49.53 48.51,50.8 46.99,50.8 45.97,49.78 31.34,49.78 LED2B.C
N$23
  Top 0.254: LED3B.C 38.76,51.92 40.39,50.29 45.72,50.29 46.74,51.31 48.77,51.31 50.04,50.04 55.12,50.04 56.64,48.51 60.71,48.51 62.74,46.48 71.63,46.48 75.18,42.93 75.18,39.61 LED_DRIVER.22
N$24
  Top 0.254: LED_DRIVER.21 75.94,42.94 71.88,46.99 62.99,46.99 60.96,49.02 56.9,49.02 55.37,50.55 50.29,50.55 49.02,51.82 44.55,51.82 LED4B.C
N$25
  Top 0.254: LED_DRIVER.20 76.58,43.3 72.39,47.5 63.5,47.5 61.47,49.53 57.15,49.53 54.86,51.82 52.17,51.82 LED5B.C
N$26
  Top 0.254: LED_DRIVER.19 77.23,43.67 72.9,48.01 64.01,48.01 60.45,51.56 60.05,51.56 LED6B.C
N$27
  Top 0.254: LED_DRIVER.18 77.89,44.03 70.36,51.56 67.67,51.56 LED7B.C
N$28
  Top 0.254: LED_DRIVER.17 78.53,48.31 LED8B.C
SEN1A
  Top 0.254: ADC_1.16 24.18,33.83 19.05,28.7 17.02,28.7 9.4,21.08 9.14,21.18 RES1A.2 13.06,17.02 21.08,17.02 25.15,12.95 25.15,10.92 25.91,10.16 27.94,10.16 ZIPLINK.3
SEN1B
  Top 0.254: ZIPLINK.5 31.24,8.89 29.97,10.16 28.96,10.16 27.94,11.18 27.94,12.19 27.18,12.95 26.16,12.95 21.59,17.53 15.34,17.53 RES1B.2 12.19,20.68 12.19,22.86 14.48,25.15 15.49,25.15 18.54,28.19 19.75,28.19 24.38,32.83 ADC_1.18
SEN2A
  Top 0.254: ZIPLINK.13 40.64,10.16 38.61,10.16 38.1,10.67 38.1,12.19 30.48,19.81 RES2A.1 29.62,21.44 28.7,22.35 28.7,31.5 29.97,32.83 ADC_1.21
SEN2B
  Top 0.254: ZIPLINK.15 43.94,8.89 42.67,10.16 41.66,10.16 40.64,11.18 40.64,13.82 RES2B.1 34.7,18.9 33.78,19.81 33.78,26.92 32.51,28.19 32.51,33.27 32,33.83 30.89,33.83 ADC_1.23
SEN3A
  Top 0.254: ZIPLINK.14 41.91,20.17 RES3A.1 | RES3A.1 40.28,21.44 | RES3A.1 42.16,22.96 42.16,25.4 41.4,26.16 35.56,26.16 33.02,28.7 33.02,33.53 31.75,34.84 30.87,34.84 ADC_1.25
SEN3B
  Top 0.254: ZIPLINK.16 44.45,17.63 RES3B.1 42.93,21.69 42.93,25.65 41.66,26.92 35.81,26.92 33.53,29.21 33.53,34.04 31.75,35.81 30.86,35.81 ADC_1.27 31.23,35.83
SEN4A
  Top 0.254: ADC_1.12 25.06,35.81 26.16,35.81 27.18,34.8 27.18,17.78 33.02,11.94 33.02,10.67 32.51,10.16 31.24,10.16 30.48,10.92 29.72,10.92 ZIPLINK.4 28.7,11.94 28.7,12.45 27.43,13.72 26.42,13.72 21.08,19.05 20.57,19.05 19.56,20.07 19.56,20.93 RES4A.2
SEN4B
  Top 0.254: 24.13,18.54 RES4B.2 | ADC_1.14 26.13,34.83 26.67,34.29 26.67,21.44 RES4B.2 | ZIPLINK.6 25.15,18.03 24.99,18.03 RES4B.2
SEN5A
  Top 0.254: ZIPLINK.23 54.1,8.89 52.83,10.16 51.31,10.16 50.8,10.67 50.8,12.19 52.07,13.46 52.07,20.17 RES5A.2 50.8,21.59 51.82,21.59 52.58,22.35 52.58,25.4 51.82,26.16 49.02,26.16 44.7,30.48 44.7,33.27 45.21,33.83 46.58,33.83 ADC_2.16
SEN5B
  Top 0.254: ZIPLINK.25 56.9,8.89 55.63,10.16 54.1,10.16 53.34,10.92 53.34,16.76 53.75,16.76 RES5B.2 55.27,18.9 53.59,20.57 53.59,25.65 51.82,27.43 48.77,27.43 45.47,30.73 45.47,32.83 46.57,32.83 ADC_2.18
SEN6A
  Top 0.254: 70.87,21.18 70.87,19.3 63.5,11.94 63.5,10.67 64.01,10.16 65.53,10.16 66.8,8.89 ZIPLINK.33 | 70.87,21.18 RES6A.1 | 70.87,21.18 70.87,21.34 71.12,21.59 70.87,21.59 67.56,24.89 65.79,24.89 63.25,27.43 55.37,27.43 52.83,29.97 52.32,29.97 51.05,31.24 51.05,32.51 51.31,32.83 ADC_2.21
SEN6B
  Top 0.254: ZIPLINK.35 69.09,8.89 67.82,10.16 66.55,10.16 66.04,10.67 66.04,11.94 72.39,18.29 75.59,18.29 RES6B.1 76.05,19.05 74.93,19.05 73.15,20.83 73.15,25.15 72.39,25.91 68.33,25.91 65.28,28.96 58.42,28.96 53.55,33.83 ADC_2.23
SEN7A
  Top 0.254: ZIPLINK.34 72.39,16.51 77.47,16.51 81.28,20.32 RES7A.1 81.64,21.08 81.79,21.08 84.07,23.37 84.07,25.4 81.79,26.42 68.58,26.42 65.53,29.46 58.93,29.46 53.56,34.83 ADC_2.25
SEN7B
  Top 0.254: ZIPLINK.36 69.85,11.94 73.41,15.49 82.96,15.49 RES7B.1 84.84,20.42 84.84,25.91 82.04,27.18 68.58,27.18 65.79,29.97 59.44,29.97 53.58,35.83 ADC_2.27
SEN8A
  Top 0.254: RES8A.2 60.86,21.44 60.86,20.22 54.61,13.97 ZIPLINK.24 55.37,11.43 56.64,10.16 57.91,10.16 58.42,10.67 58.42,15.49 59.44,16.51 66.55,16.51 68.07,18.03 68.07,23.37 67.31,24.13 65.53,24.13 62.99,26.67 55.12,26.67 52.83,28.96 50.55,28.96 49.02,30.48 49.02,34.54 47.75,35.81 46.65,35.81 ADC_2.12
SEN8B
  Top 0.254: ZIPLINK.26 57.15,15.24 60.96,19.05 65.89,19.05 RES8B.2 67.56,20.42 67.56,23.11 67.06,23.62 65.02,23.62 62.74,25.91 54.61,25.91 54.61,26.16 52.58,28.19 50.29,28.19 48.26,30.23 48.26,34.29 47.72,34.83 ADC_2.14
TLC_BLANK  (via drill 0.5)
  Top 0.254: LED_DRIVER.2 69.44,30.57 69.09,30.23 68.07,30.23 66.8,31.5 64.87,31.5 R2.2 63.35,33.17 59.69,36.83 v59.69,46.74
  Bottom 0.254: BUS_IN.5 10.41,46.74 v59.69,46.74 88.39,46.74 89.92,48.26 91.19,48.26 92.46,46.99 BUS_OUT.5
TLC_SIN  (via drill 0.5)
  Top 0.254: LED_DRIVER.4 70.73,30.35 69.34,28.96 67.82,28.96 66.29,30.48 64.26,30.48 63.75,30.99 60.96,30.99 58.67,33.27 58.67,42.67 v57.66,43.69
  Bottom 0.254: v57.66,43.69 11.43,43.69 10.92,43.18 8.89,43.18 BUS_IN.4
TLC_SOUT  (via drill 0.5)
  Top 0.254: v71.63,43.69 71.63,43.18 70.87,42.42 70.87,39.64 LED_DRIVER.29
  Bottom 0.254: BUS_OUT.4 89.92,44.45 89.15,43.69 v71.63,43.69
TLC_XLAT  (via drill 0.5)
  Top 0.254: v70.1,44.45 70.1,39.53 LED_DRIVER.30
  Bottom 0.254: BUS_OUT.3 91.44,45.72 89.66,45.72 88.39,44.45 v70.1,44.45 BUS_IN.3
VCC  (via drill 0.5)  (1 unrouted)
  Top 0.254: 29.72,39.33 30.8,39.33 ADC_1.34 33.3,39.33 C7.1 34.73,39.88 35.56,39.88 36.32,39.12 36.32,34.8 | ADC_1.30 29.98,37.33 29.72,37.59 | C8.1 35.37,33.85 36.32,34.8 | ADC_2.2 49.09,40.83 49.4,40.51 50.55,39.33 52.39,39.33 ADC_2.34 53.81,39.33 54.61,40.13 54.61,40.83 C16.1 55.88,41.91 57.15,41.91 57.66,41.4 57.66,36.58 56.71,35.63 C17.1 54.68,37.33 ADC_2.30 | 67.13,39.51 LED_DRIVER.32 | C6.2 21.59,34.61 21.59,35.05 23.88,37.34 23.88,37.33 ADC_1.9 29.46,37.34 29.72,37.59 | ADC_1.2 28.26,40.83 29.72,39.33 | 29.72,39.33 29.72,37.59 | 43.18,34.61 43.18,34.8 45.71,37.33 ADC_2.9 | 43.18,34.61 C15.2 | 43.18,34.61 43.18,34.54 41.91,33.27 37.85,33.27 36.32,34.8
  Top 0.508: LED6B.A 76.05,54.76 81.28,49.53 v81.28,42.67 | v49.78,42.67 49.78,40.89 49.4,40.51 | 36.32,39.12 36.32,41.4 v37.59,42.67 | C18.1 65.72,38.03 v67.06,39.37
  Top 0.762: IC2.3 53.34,64.77
  Top 1.016: 53.34,64.77 59.37,64.77 C10.1 | C10.1 C11.1 | C10.1 77,64.45 79.93,67.39 | LED1B.A LED2B.A LED3B.A LED4B.A LED5B.A LED6B.A LED7B.A LED8B.A 77.62,54.76 85.09,62.23 85.09,68.58 83.82,69.85 81.28,69.85 80.01,68.58 80.01,67.46 79.93,67.39 | LED3V3.A 80.01,67.31 79.93,67.39
  Bottom 0.508: v81.28,42.67 67.06,42.67 | 67.06,42.67 v49.78,42.67 v37.59,42.67 | v67.06,39.37 67.06,42.67

### Text on the board
tPlace: 4 3 8 7 | 1 2 5 6 | 5V SENA SENB LED+ LED-
tNames: MS_8-ADC-PWM | 1 2 3 4 5 6 7 8 | ADC_SDI / DAISY_IN / CLK / TLC_SIN / GND | ADC_SDO / ADC_CS / TLC_BLANK / TLC_XLAT / GND | ADC_SDI / DAISY_OUT / CLK / TLC_SOUT / GND | ADC_SDO / ADC_CS / TLC_BLANK / TLC_XLAT / GND | v1 / 2018 / DTLJ